# EAGLE schematic rcsdcard_v2 (EAGLE 9.6.2)
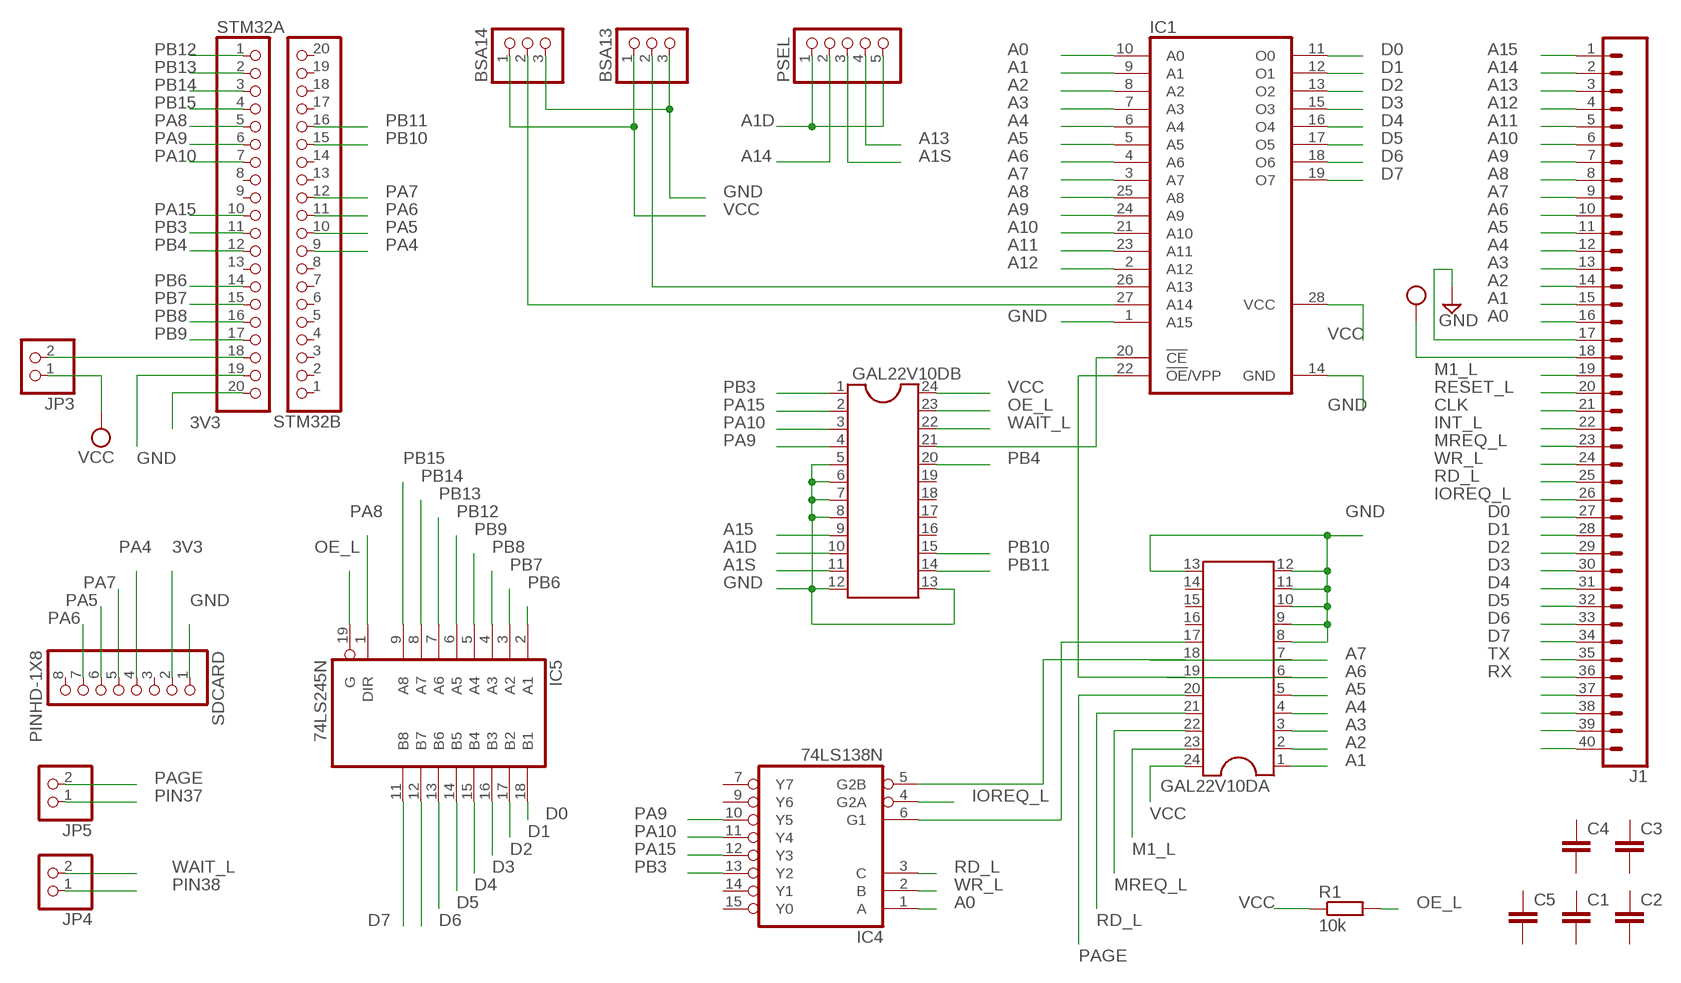
[diagram p0: schematic, sheet 1]

## Parts
BSA13  PINHD-1X3  [1X03]
BSA14  PINHD-1X3  [1X03]
C1  C-EU050-025X075  [C050-025X075]
C2  C-EU050-025X075  [C050-025X075]
C3  C-EU050-025X075  [C050-025X075]
C4  C-EU050-025X075  [C050-025X075]
C5  C-EU050-025X075  [C050-025X075]
GAL22V10DA  DIL24-3  [DIL24-3]
GAL22V10DB  DIL24-3  [DIL24-3]
IC1  27C512D  [DIL28-6]
IC4  74LS138N  [DIL16]
IC5  74LS245N  [DIL20]
J1  CONN_40OFFSET  [1X40_OFFSET]
JP3  PINHD-1X2  [1X02]
JP4  PINHD-1X2  [1X02]
JP5  PINHD-1X2  [1X02]
PSEL  PINHD-1X5  [1X05]
R1  10k  R-EU_0204/7  [0204/7]
SDCARD  PINHD-1X8  [1X08]
STM32A  PINHD-1X20  [1X20]
STM32B  PINHD-1X20  [1X20]

## Nets
3V3: SDCARD.2 STM32A.20
A0: IC1.10(A0) IC4.1(A) J1.16
A1: GAL22V10DA.1 IC1.9(A1) J1.15
A1D: GAL22V10DB.10 PSEL.1 PSEL.5
A1S: GAL22V10DB.11 PSEL.3
A2: GAL22V10DA.2 IC1.8(A2) J1.14
A3: GAL22V10DA.3 IC1.7(A3) J1.13
A4: GAL22V10DA.4 IC1.6(A4) J1.12
A5: GAL22V10DA.5 IC1.5(A5) J1.11
A6: GAL22V10DA.6 IC1.4(A6) J1.10
A7: GAL22V10DA.7 IC1.3(A7) J1.9
A8: IC1.25(A8) J1.8
A9: IC1.24(A9) J1.7
A10: IC1.21(A10) J1.6
A11: IC1.23(A11) J1.5
A12: IC1.2(A12) J1.4
A13: J1.3 PSEL.4
A14: J1.2 PSEL.2
A15: GAL22V10DB.9 J1.1
CLK: J1.21
D0: IC1.11(O0) IC5.18(B1) J1.27
D1: IC1.12(O1) IC5.17(B2) J1.28
D2: IC1.13(O2) IC5.16(B3) J1.29
D3: IC1.15(O3) IC5.15(B4) J1.30
D4: IC1.16(O4) IC5.14(B5) J1.31
D5: IC1.17(O5) IC5.13(B6) J1.32
D6: IC1.18(O6) IC5.12(B7) J1.33
D7: IC1.19(O7) IC5.11(B8) J1.34
GND: BSA13.3 BSA14.3 GAL22V10DA.8 GAL22V10DA.9 GAL22V10DA.10 GAL22V10DA.11 GAL22V10DA.12 GAL22V10DA.13 GAL22V10DB.5 GAL22V10DB.6 GAL22V10DB.7 GAL22V10DB.8 GAL22V10DB.12 GAL22V10DB.13 IC1.1(A15) IC1.14(GND) J1.17 SDCARD.1 STM32A.19
INT_L: J1.22
IOREQ_L: IC4.4(G2A) J1.26
M1_L: GAL22V10DA.23 J1.19
MREQ_L: GAL22V10DA.22 J1.23
N$1: J1.37
N$2: J1.38
N$3: J1.39
N$4: GAL22V10DA.19 IC1.22(!OE!/VPP)
N$5: JP3.2 STM32A.18
N$6: GAL22V10DB.21 IC1.20(!CE)
N$9: GAL22V10DA.17 IC4.6(G1)
N$12: GAL22V10DA.18 IC4.5(G2B)
N$13: J1.40
N$31: BSA13.2 IC1.26(A13)
N$32: BSA14.2 IC1.27(A14)
OE_L: GAL22V10DB.23 IC5.19(G) R1.2
PA4: SDCARD.4 STM32B.9
PA5: SDCARD.6 STM32B.10
PA6: SDCARD.7 STM32B.11
PA7: SDCARD.5 STM32B.12
PA8: IC5.1(DIR) STM32A.5
PA9: GAL22V10DB.4 IC4.10(Y5) STM32A.6
PA10: GAL22V10DB.3 IC4.11(Y4) STM32A.7
PA15: GAL22V10DB.2 IC4.12(Y3) STM32A.10
PAGE: GAL22V10DA.20 JP5.2
PB3: GAL22V10DB.1 IC4.13(Y2) STM32A.11
PB4: GAL22V10DB.20 STM32A.12
PB6: IC5.2(A1) STM32A.14
PB7: IC5.3(A2) STM32A.15
PB8: IC5.4(A3) STM32A.16
PB9: IC5.5(A4) STM32A.17
PB10: GAL22V10DB.15 STM32B.15
PB11: GAL22V10DB.14 STM32B.16
PB12: IC5.6(A5) STM32A.1
PB13: IC5.7(A6) STM32A.2
PB14: IC5.8(A7) STM32A.3
PB15: IC5.9(A8) STM32A.4
PIN37: JP5.1
PIN38: JP4.1
RD_L: GAL22V10DA.21 IC4.3(C) J1.25
RESET_L: J1.20
RX: J1.36
TX: J1.35
VCC: BSA13.1 BSA14.1 GAL22V10DA.24 GAL22V10DB.24 IC1.28(VCC) J1.18 JP3.1 R1.1
WAIT_L: GAL22V10DB.22 JP4.2
WR_L: IC4.2(B) J1.24
Unconnected: C1.1 C1.2 C2.1 C2.2 C3.1 C3.2 C4.1 C4.2 C5.1 C5.2 GAL22V10DA.14 GAL22V10DA.15 GAL22V10DA.16 GAL22V10DB.16 GAL22V10DB.17 GAL22V10DB.18 GAL22V10DB.19 IC4.7(Y7) IC4.9(Y6) IC4.14(Y1) IC4.15(Y0) SDCARD.3 SDCARD.8 STM32A.8 STM32A.9 STM32A.13 STM32B.1 STM32B.2 STM32B.3 STM32B.4 STM32B.5 STM32B.6 STM32B.7 STM32B.8 STM32B.13 STM32B.14 STM32B.17 STM32B.18 STM32B.19 STM32B.20

## Power pins joined to a net without a drawn wire
GND: IC4.8(GND) IC5.10(GND)
VCC: IC4.16(VCC) IC5.20(VCC)

## Library data of the parts
BSA13 BSA14 = pinhead:PINHD-1X3: PIN HEADER
C1-C5 = rcl:C-EU: CAPACITOR, European symbol; SPICEPREFIX: C
GAL22V10DA GAL22V10DB = ic-package:DIL24: Dual In Line
IC1 = memory-nec:27C512D: MEMORY; MPN: M27C512-10F1; OC_FARNELL: 1661676; OC_NEWARK: 56P9224
IC4 = 74xx-eu:74*138: 3-line to 8-line DECODER/DEMULTIPLEXER
IC5 = 74xx-eu:74*245: Octal BUS TRANSCEIVER, 3-state
J1 = SparkFun-Connectors:CONN_40: Multi connection point. Often used as Generic Header-pin footprint for 0.1 inch spaced/style header connections On any of the 0.1 inch spaced packages, you can populate with these: Break Away Headers - Straight <https://www.sparkfun.com/products/116> (PRT-00116) Break Away Male Headers - Right Angle <https://www.sparkfun.com/products/553> (PRT-00553) Female Headers <https://www.sparkfun.com/products/115> (PRT-00115) Break Away Headers - Machine Pin <https://www.sparkfun.com/products/117> (PRT-00117) Break Away Female Headers - Swiss Machine Pin <https://www.sparkfun.com/products/743> (PRT-00743) For SCREWTERMINALS and SPRING TERMINALS visit here: Screw Terimnals on SparkFun.com <https://www.sparkfun.com/search/results?term=Screw+Terminals> (5mm/3.5mm/2.54mm spacing) This device is also useful as a general connection point to wire up your design to another part of your project. Our various solder wires solder well into these plated through hole pads. Hook-Up Wire - Assortment (Stranded, 22 AWG) <https://www.sparkfun.com/products/11375> (PRT-11375) Hook-Up Wire - Assortment (Solid Core, 22 AWG) <https://www.sparkfun.com/products/11367> (PRT-11367) View the entire wire category on our website here <https://www.sparkfun.com/categories/141> Special notes: Molex polarized connector foot print use with SKU : PRT-08231 with associated crimp pins and housings. 1MM SMD Version SKU: PRT-10208 NOTES ON THE VARIANTS LOCK and LOCK_LONGPADS... This footprint was designed to help hold the alignment of a through-hole component (i.e. 6-pin header) while soldering it into place. You may notice that each hole has been shifted either up or down by 0.005 of an inch from it's more standard position (which is a perfectly straight line). This slight alteration caused the pins (the squares in the middle) to touch the edges of the holes. Because they are alternating, it causes a "brace" to hold the component in place. 0.005 has proven to be the perfect amount of "off-center" position when using our standard breakaway headers. Although looks a little odd when you look at the bare footprint, once you have a header in there, the alteration is very hard to notice. Also,if you push a header all the way into place, it is covered up entirely on the bottom side.
JP3-JP5 = pinhead:PINHD-1X2: PIN HEADER
PSEL = pinhead:PINHD-1X5: PIN HEADER
R1 = rcl:R-EU_: RESISTOR, European symbol; SPICEPREFIX: R
SDCARD = Connector:PINHD-1X8: PIN HEADER; CATEGORY: CONNECTOR; SUB-CATEGORY: PIN-HEADER
STM32A STM32B = pinhead:PINHD-1X20: PIN HEADER